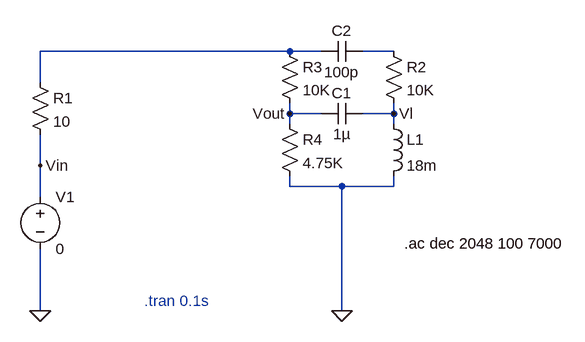
[diagram p0: schematic wdf_Rnode.asc]
wdf_Rnode.asc, the LTspice schematic file:
Version 4
SHEET 1 1000 680
WIRE 544 96 160 96
WIRE 592 96 544 96
WIRE 704 96 656 96
WIRE 160 144 160 96
WIRE 544 192 544 176
WIRE 592 192 544 192
WIRE 704 192 704 176
WIRE 704 192 656 192
WIRE 544 208 544 192
WIRE 704 208 704 192
WIRE 160 272 160 224
WIRE 544 304 544 288
WIRE 624 304 544 304
WIRE 704 304 704 288
WIRE 704 304 624 304
WIRE 160 320 160 272
WIRE 160 496 160 400
WIRE 624 496 624 304
FLAG 160 496 0
FLAG 624 496 0
FLAG 160 272 Vin
FLAG 704 192 Vl
FLAG 544 192 Vout
SYMBOL /res 144 128 R0
SYMATTR InstName R1
SYMATTR Value 10
SYMBOL /res 688 80 R0
SYMATTR InstName R2
SYMATTR Value 10K
SYMBOL /res 528 80 R0
SYMATTR InstName R3
SYMATTR Value 10K
SYMBOL /res 528 192 R0
SYMATTR InstName R4
SYMATTR Value 4.75K
SYMBOL /voltage 160 304 R0
SYMATTR InstName V1
SYMATTR Value 0
SYMATTR Value2 AC 1
SYMBOL /cap 656 176 R90
WINDOW 0 0 32 VBottom 2
WINDOW 3 32 32 VTop 2
SYMATTR InstName C1
SYMATTR Value 1µ
SYMBOL /cap 656 80 R90
WINDOW 0 0 32 VBottom 2
WINDOW 3 32 32 VTop 2
SYMATTR InstName C2
SYMATTR Value 100p
SYMBOL /ind 688 192 R0
SYMATTR InstName L1
SYMATTR Value 18m
TEXT 320 480 Left 2 ;.tran 0.1s
TEXT 720 392 Left 2 !.ac dec 2048 100 7000

The netlist it stands for:
* wdf_Rnode.asc
R1 N001 Vin 10
R2 N002 Vl 10K
R3 N001 Vout 10K
R4 Vout 0 4.75K
V1 Vin 0 0 AC 1
C1 Vl Vout 1µ
C2 N002 N001 100p
L1 Vl 0 18m
* .tran 0.1s
.ac dec 2048 100 7000
.backanno
.end

* Results of the author's LTspice run, read from the files saved beside the schematic
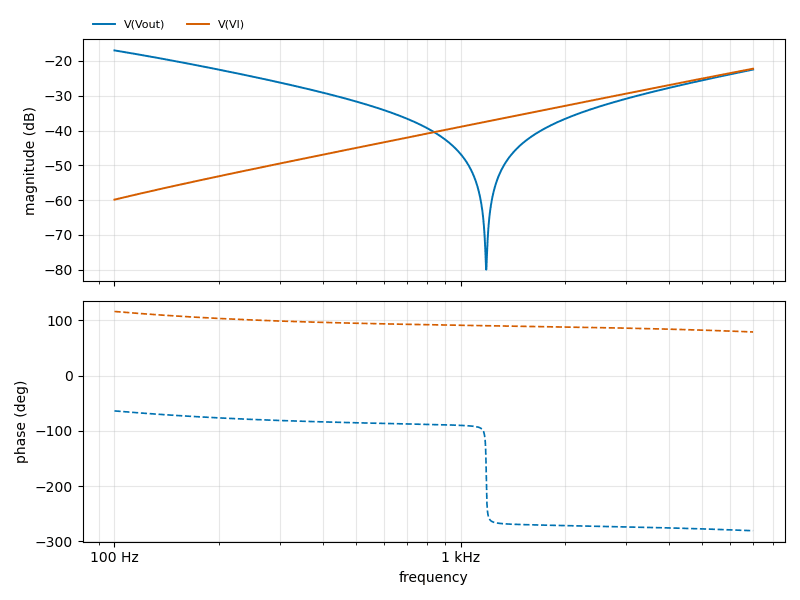
[diagram p1: AC Analysis of wdf_Rnode.asc, plotted from the saved traces]
* AC Analysis, 1 run:
*   V(Vout): -16.97 dB at 100 Hz, -22.48 dB at 7 kHz, peak -16.97 dB at 100 Hz, 3 dB below the peak at 148.4 Hz
*   V(Vl): -59.87 dB at 100 Hz, -22.22 dB at 7 kHz, peak -22.22 dB at 7 kHz, 3 dB below the peak at 4.892 kHz